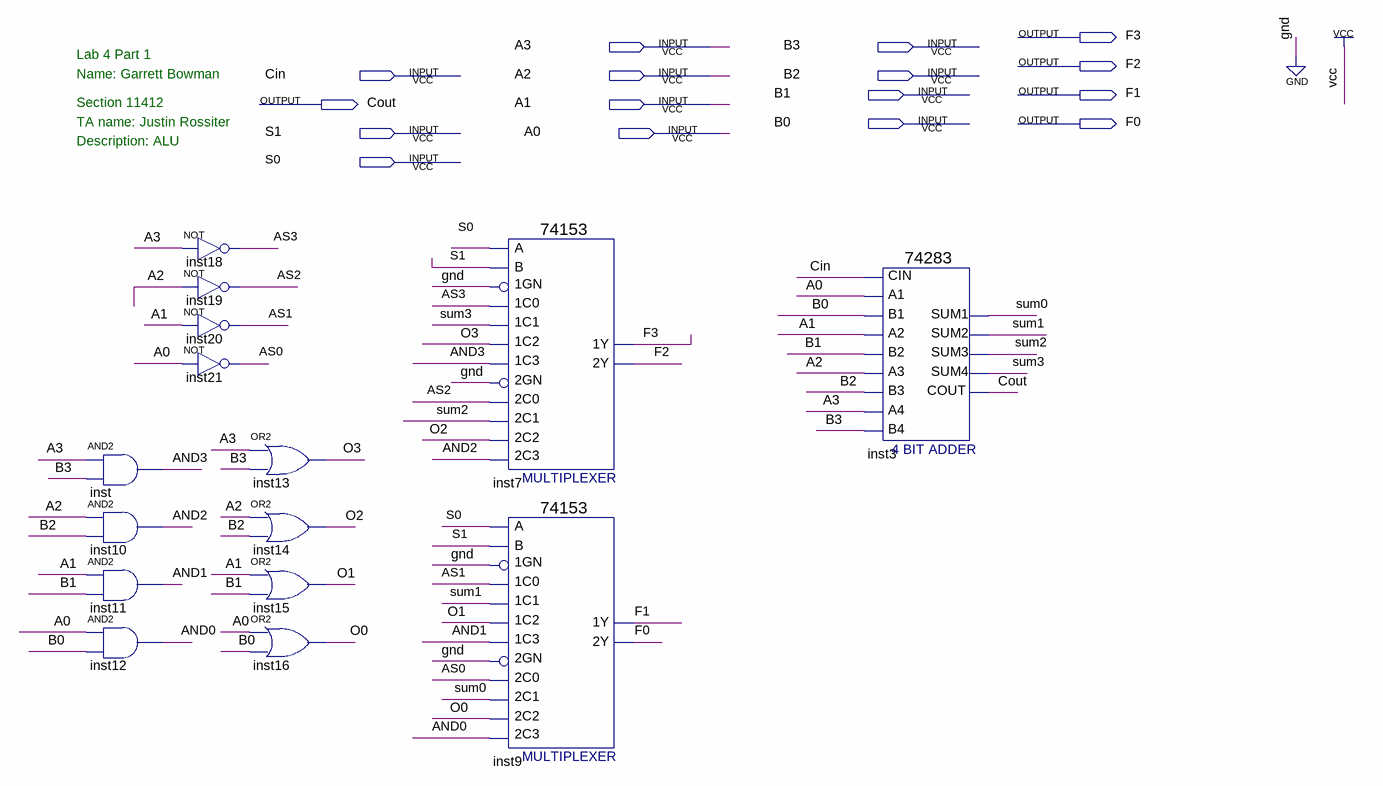
[diagram p0: schematic sheet]
// Quartus schematic Lab4_ALU.bdf as structural Verilog: 15 symbols, 16 pins
module Lab4_ALU (
  input  A3,
  input  B3,
  input  Cin,
  input  A2,
  input  B2,
  input  B1,
  input  A1,
  input  B0,
  input  S1,
  input  A0,
  input  S0,
  output F3,
  output F2,
  output F1,
  output Cout,
  output F0
);

  wire AND0, AND1, AND2, AND3, AS0, AS1, AS2, AS3, O0, O1, O2, O3, sum0, sum1, sum2, sum3;

  and inst (AND3, A3, B3);
  and inst10 (AND2, A2, B2);
  and inst11 (AND1, A1, B1);
  and inst12 (AND0, A0, B0);
  not inst18 (AS3, A3);
  not inst19 (AS2, A2);
  not inst20 (AS1, A1);
  not inst21 (AS0, A0);
  or inst13 (O3, A3, B3);
  or inst14 (O2, A2, B2);
  or inst15 (O1, A1, B1);
  or inst16 (O0, A0, B0);
  \74153  inst7 (
    .\1C1 (sum3), .\1GN (1'b0), .\1C0 (AS3), .\2C0 (AS2), .\2GN (1'b0), .\2C2 (O2), .\1C2 (O3), .\1C3 (AND3),
    .B(S1), .A(S0), .\2C1 (sum2), .\2C3 (AND2), .\1Y (F3), .\2Y (F2));
  \74153  inst9 (
    .\1C1 (sum1), .\1GN (1'b0), .\1C0 (AS1), .\2C0 (AS0), .\2GN (1'b0), .\2C2 (O0), .\1C2 (O1), .\1C3 (AND1),
    .B(S1), .A(S0), .\2C1 (sum0), .\2C3 (AND0), .\1Y (F1), .\2Y (F0));
  \74283  inst3 (
    .CIN(Cin), .A1(A0), .A2(A1), .B2(B1), .A3(A2), .A4(A3), .B4(B3), .B1(B0), .B3(B2), .SUM4(sum3),
    .COUT(Cout), .SUM1(sum0), .SUM2(sum1), .SUM3(sum2));

  // Notes on the sheet:
  //   Lab 4 Part 1
  //   Name: Garrett Bowman
  //   Section 11412
  //   TA name: Justin Rossiter
  //   Description: ALU
endmodule
